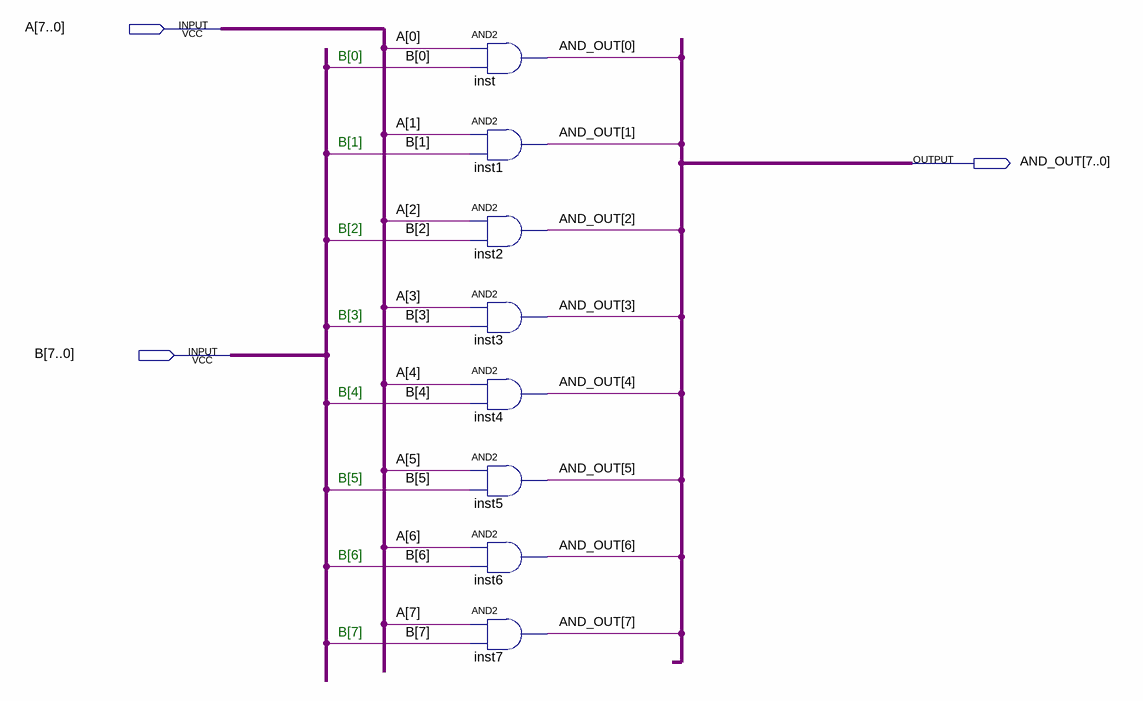
[diagram p0: schematic sheet]
// Quartus schematic AND-PJ2.bdf as structural Verilog: 8 symbols, 3 pins
module \AND-PJ2  (
  input  [7:0] A,
  input  [7:0] B,
  output [7:0] AND_OUT
);

  and inst (AND_OUT[0], A[0], B[0]);
  and inst1 (AND_OUT[1], A[1], B[1]);
  and inst2 (AND_OUT[2], A[2], B[2]);
  and inst3 (AND_OUT[3], A[3], B[3]);
  and inst4 (AND_OUT[4], A[4], B[4]);
  and inst5 (AND_OUT[5], A[5], B[5]);
  and inst6 (AND_OUT[6], A[6], B[6]);
  and inst7 (AND_OUT[7], A[7], B[7]);

  // Notes on the sheet:
  //   B[0]
  //   B[1]
  //   B[2]
  //   B[3]
  //   B[4]
  //   B[5]
  //   B[6]
  //   B[7]
endmodule
